# Altium schematic sheet power source selector.SchDoc: myA4
size A4; Date: 2018/01/06; DrawnBy: 亓岳鑫; Organization: Altium Limited; Address1: 3 Minna Close; Address2: Belrose; Address3: NSW 2085; Address4: Australia; DocumentNumber: 1; Revision: Beta 1.0.1; SheetNumber: 91; SheetTotal: 100; Time: 17:30
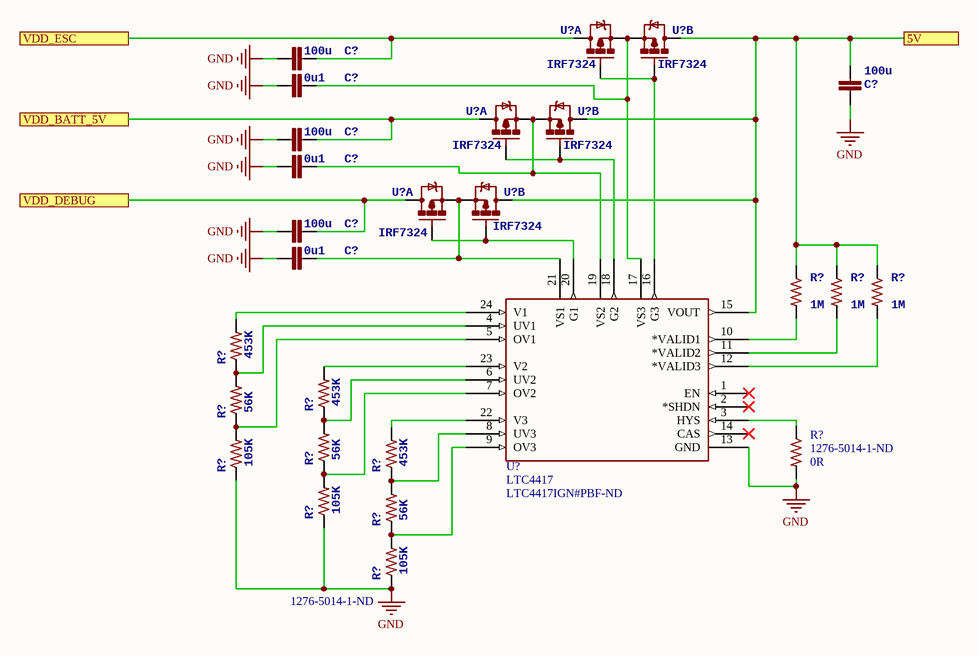
[diagram p0: power source selector.SchDoc]

## Parts
(Parts that share a designator on the sheet are numbered #1, #2 ... from top to bottom, then left to right.)
C?#1  100u  [1206-CAP]
C?#2  100u  [1206-CAP]
C?#3  0u1  [0402-CAP]
C?#4  100u  [1206-CAP]
C?#5  0u1  [0402-CAP]
C?#6  100u  [1206-CAP]
C?#7  0u1  [0402-CAP]
R?#1  1M  [0603-RES]
R?#2  1M  [0603-RES]
R?#3  1M  [0603-RES]
R?#4  453K  [0603-RES]
R?#5  453K  [0603-RES]
R?#6  56K  [0603-RES]
R?#7  56K  [0603-RES]
R?#8  0R  Supplier Part Number 1: 1276-5014-1-ND  [0603-RES]
R?#9  105K  [0603-RES]
R?#10  453K  [0603-RES]
R?#11  105K  [0603-RES]
R?#12  56K  [0603-RES]
R?#13  105K  Supplier Part Number 1: 1276-5014-1-ND  [0603-RES]
U?#1  IRF7324  [SO08]  (part A of 2)
U?#2  IRF7324  [SO08]  (part B of 2)
U?#3  IRF7324  [SO08]  (part A of 2)
U?#4  IRF7324  [SO08]  (part B of 2)
U?#5  IRF7324  [SO08]  (part A of 2)
U?#6  IRF7324  [SO08]  (part B of 2)
U?#7  LTC4417  Supplier Part Number 1: LTC4417IGN#PBF-ND  [SSOP-24_GN]

## Ports
5V, VDD_BATT_5V, VDD_DEBUG, VDD_ESC

## Nets
GND: C?#1.P$1 C?#2.P$1 C?#3.P$1 C?#4.P$1 C?#5.P$1 C?#6.P$1 C?#7.P$1 R?#8.2 R?#9.1 R?#11.1 R?#13.1 U?#7.13(GND)
5V: C?#2.P$2 R?#1.1 R?#2.1 R?#3.1 U?#2.5(D) U?#4.5(D) U?#6.5(D) U?#7.15(VOUT) ; port 5V
VDD_BATT_5V: C?#4.P$2 U?#3.7(D) ; port VDD_BATT_5V
VDD_DEBUG: C?#6.P$2 U?#5.7(D) ; port VDD_DEBUG
VDD_ESC: C?#1.P$2 U?#1.7(D) ; port VDD_ESC
NetC?#3_P$2: C?#3.P$2 U?#1.1(S) U?#2.3(S) U?#7.17(VS3)
NetC?#5_P$2: C?#5.P$2 U?#3.1(S) U?#4.3(S) U?#7.19(VS2)
NetC?#7_P$2: C?#7.P$2 U?#5.1(S) U?#6.3(S) U?#7.21(VS1)
NetR?#1_2: R?#1.2 U?#7.10(*VALID1)
NetR?#2_2: R?#2.2 U?#7.11(*VALID2)
NetR?#3_2: R?#3.2 U?#7.12(*VALID3)
NetR?#4_1: R?#4.1 R?#6.2 U?#7.4(UV1)
NetR?#4_2: R?#4.2 U?#7.24(V1)
NetR?#5_1: R?#5.1 R?#7.2 U?#7.6(UV2)
NetR?#5_2: R?#5.2 U?#7.23(V2)
NetR?#6_1: R?#6.1 R?#9.2 U?#7.5(OV1)
NetR?#7_1: R?#7.1 R?#11.2 U?#7.7(OV2)
NetR?#8_1: R?#8.1 U?#7.3(HYS)
NetR?#10_1: R?#10.1 R?#12.2 U?#7.8(UV3)
NetR?#10_2: R?#10.2 U?#7.22(V3)
NetR?#12_1: R?#12.1 R?#13.2 U?#7.9(OV3)
NetU?#1_2: U?#1.2(G) U?#2.4(G) U?#7.16(G3)
NetU?#3_2: U?#3.2(G) U?#4.4(G) U?#7.18(G2)
NetU?#5_2: U?#5.2(G) U?#6.4(G) U?#7.20(G1)

Not connected (* = marked no-connect by the designer): U?#7 1(EN)* 2(*SHDN)* 14(CAS)*

## Notes on the sheet
- Title:
- Drawn by:
- Date:
- @
- Sheet:
- /

## Library data of the parts
C?#1 C?#2 C?#4 C?#6 = CAP1206-100uF: CAP CER 100UF 10V 20% X5R 1206; PARTNO: C3216X5R1A107M160AC; 3DR_PARTNO: ECM0716; Supplier 1: Digi-Key; Supplier Part Number 1: 445-6007-1-ND; Value: 100U
C?#3 C?#5 C?#7 = CAP0603-0.1uF: Capacitor, 0.1uF, 16V, Y5V, 0402, Ceramic; PARTNO: CC0402ZRY5V7BB104; 3DR_PARTNO: ECM0700; Supplier 1: Digi-Key; Supplier Part Number 1: 311-1776-1-ND; Value: 0u1
R?#1-R?#3 = RES0603: RES 10 OHM 1/10W 5% 0603; PARTNO: RC1608J100CS; 3DR_PARTNO: ECM0811; Supplier 1: Digi-Key; Supplier Part Number 1: 1276-5014-1-ND; Value: 1M
R?#4-R?#7 R?#9-R?#13 = RESISTOR0603-RES: RES 10 OHM 1/10W 5% 0603; PARTNO: RC1608J100CS; 3DR_PARTNO: ECM0811; Supplier 1: Digi-Key
  R?#4 R?#5 R?#10: Supplier Part Number 1: 1276-5014-1-ND; Value: 453K
  R?#6 R?#7 R?#12: Supplier Part Number 1: 1276-5014-1-ND; Value: 56K
  R?#9 R?#11: Supplier Part Number 1: 1276-5014-1-ND; Value: 105K
  R?#13: Value: 105K
R?#8 = RESISTOR0603-RES: RES 10 OHM 1/10W 5% 0603; PARTNO: RC1608J100CS; 3DR_PARTNO: ECM0811; Value: 10R; Supplier 1: Digi-Key
U?#1-U?#6 = PMOSFET-DUAL: MOSFET 2P-CH 20V 2.9A CHIPFET; 3DR_PARTNO: EMC0901; Supplier 1: Digi-Key; Supplier 2: Mouser; Value: 20V 2.9A
U?#7 = LTC4417: Selects Highest Priority Supply from Three Inputs; Manufacturer_Part_Number: ltc4417ign#trpbf; Vendor: Linear Technology; Value: Value; Type: Type; RefDes: RefDes; Supplier 1: Digi-Key